# EAGLE design 4ch audio hub (EAGLE 7.7.0)
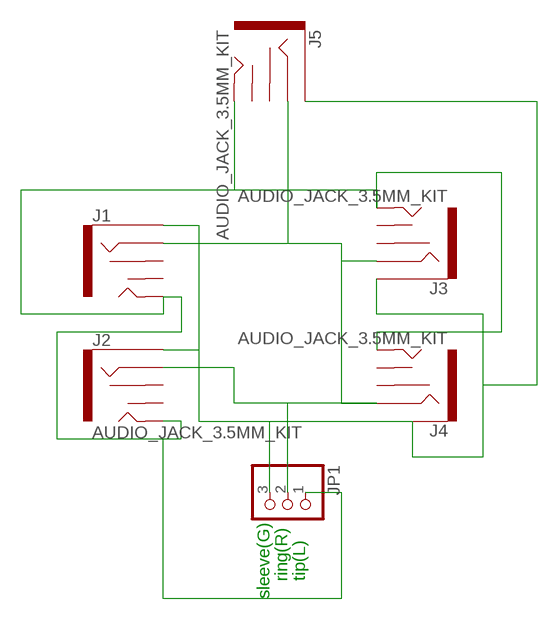
[diagram p0: schematic, sheet 1]

## Parts
J1  ring  AUDIO_JACK_3.5MM_KIT  [AUDIO-JACK-KIT]
J2  AUDIO_JACK_3.5MM_KIT  [AUDIO-JACK-KIT]
J3  AUDIO_JACK_3.5MM_KIT  [AUDIO-JACK-KIT]
J4  AUDIO_JACK_3.5MM_KIT  [AUDIO-JACK-KIT]
J5  AUDIO_JACK_3.5MM_KIT  [AUDIO-JACK-KIT]
JP1  PINHD-1X3  [1X03]

## Nets
N$1: J1.SLEEVE J2.SLEEVE J3.SLEEVE J4.SLEEVE J5.SLEEVE JP1.3
N$2: J1.RING J2.RING J3.RING J4.RING J5.RING JP1.2
N$3: J1.TIP J2.TIP J3.TIP J4.TIP J5.TIP JP1.1
Unconnected: J1.RSH J1.TSH J2.RSH J2.TSH J3.RSH J3.TSH J4.RSH J4.TSH J5.RSH J5.TSH

## Notes on the sheet
- ring(R) | tip(L)
- sleeve(G)

## Library data of the parts
J1-J5 = SparkFun-Connectors:AUDIO_JACK_3.5MM: Audio Jack 3.5mm variants of PTH and SMT stereo audio jack with bypass switches. SparkFun Products: SparkFun SparkPunk Sound Kit <[https://www.sparkfun.com/products/11177]> - PTH MP3 Trigger <https://www.sparkfun.com/products/13720> -3.5mm SMD SparkFun PicoBoard <https://www.sparkfun.com/products/11888>- 2.5mm SMD; PROD_ID: CONN-08774; SF_ID: PRT-08032
JP1 = pinhead:PINHD-1X3: PIN HEADER

## Board
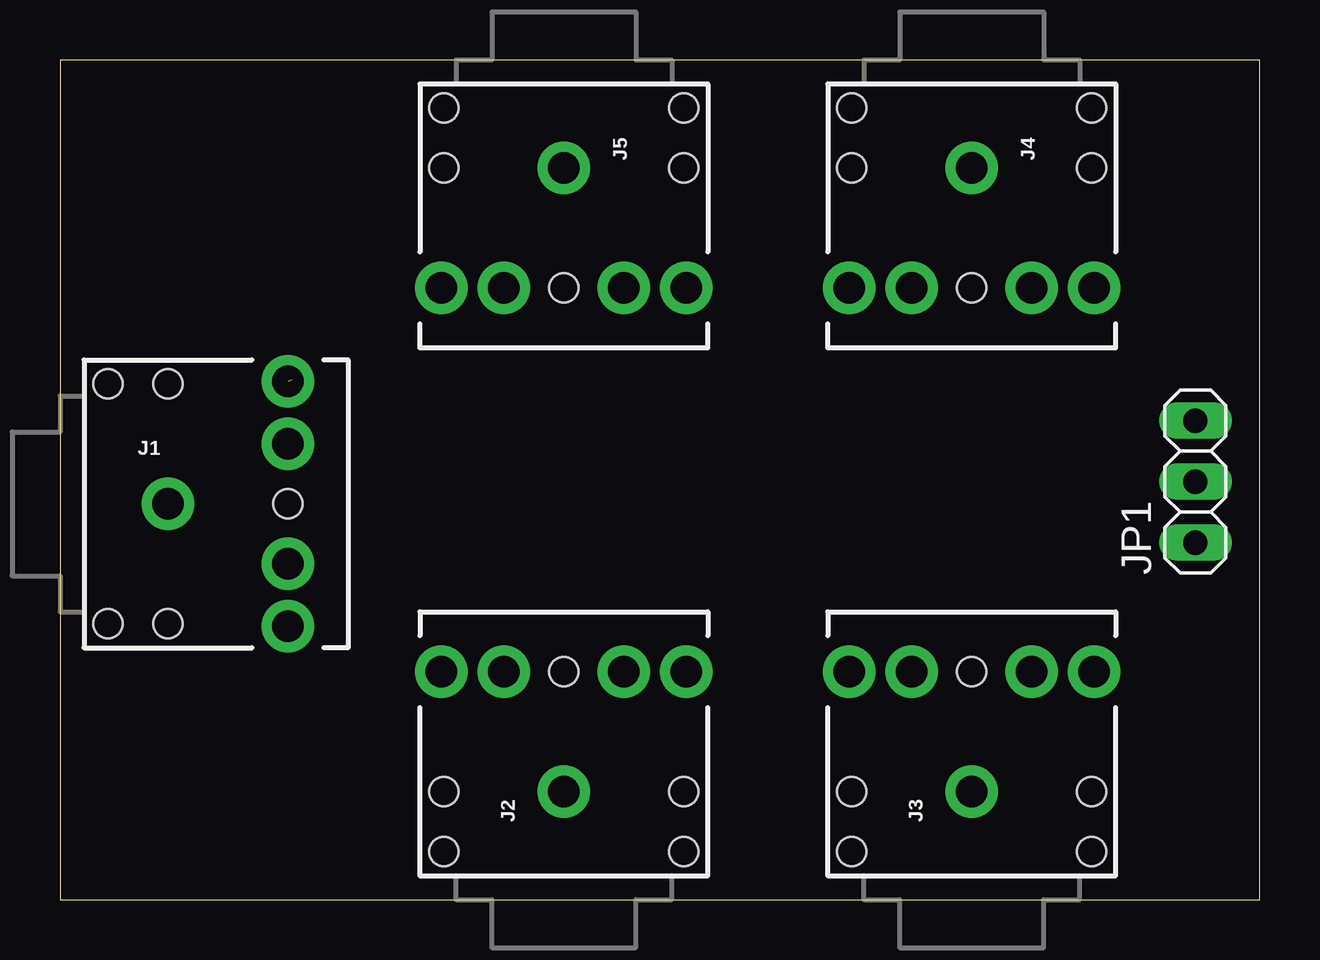
[diagram p1: board, top side]
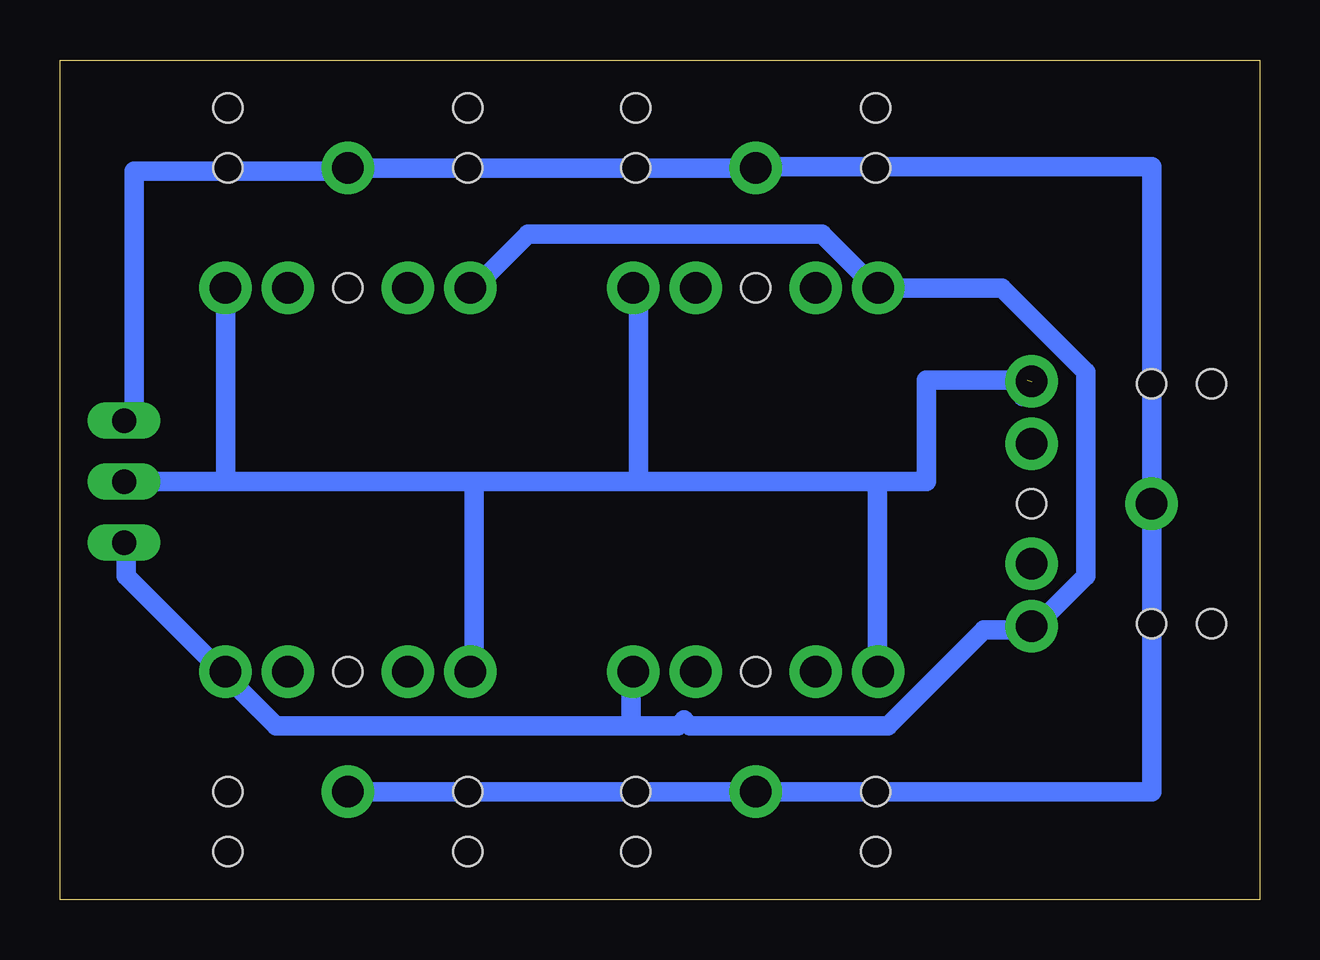
[diagram p2: board, bottom side, seen from below]

Size 50 x 35 mm. Coordinates in mm from the lower left corner, seen from the top.
Outline: 0,0 50,0 50,35 0,35 0,0
Copper layers (1*16): Top 0.035mm / dielectric 1.5mm / Bottom 0.035mm
Design rules "default *": minimum track width 32mil, minimum drill 24mil, track to track 8mil, track to pad 8mil, pad to pad 8mil, via to via 8mil, smd to smd 8mil, copper to edge 40mil, drill to drill 8mil, minimum pad ring 10mil, minimum via ring 8mil, stop-mask expansion 4mil, vias tented up to drill 0mil, thermal gap 10mil

### Footprints (pad centres in the part's own frame; a part is rotated, then mirrored left to right if it is on the bottom)
AUDIO-JACK-KIT = drill 1.3 pad 2.184: RING 5,5.1; RSH 5,2.5; SLEEVE 0,0; TIP 5,-5.1; TSH 5,-2.5 | hole 1.2: 0,5; -2.5,5; -2.5,-5; 0,-5; 5,0
1X03 = drill 1.016 long: 1 -2.54,0; 2 0,0; 3 2.54,0

### Placement (x,y rotation side)
J1  4.5,16.5 0 top
J2  21,4.5 90 top
J3  38,4.5 90 top
J4  38,30.5 270 top
J5  21,30.5 270 top
JP1  47.32,17.42 90 top

### Tracks (layer width: path | path; a pad name or v marks a point on that pad's centre or on a via)
N$1
  Bottom 0.813: JP1.3 46.9,19.96 46.9,30.36 38,30.36 J4.SLEEVE J5.SLEEVE 21,30.56 4.5,30.56 J1.SLEEVE 4.5,4.5 J2.SLEEVE J3.SLEEVE
N$2  (1 unrouted)
  Bottom 0.813: JP1.2 43.09,17.42 | 43.09,17.42 32.73,17.42 | 32.73,17.42 25.89,17.42 | 25.89,17.42 15.93,17.42 | 15.93,17.42 13.88,17.42 13.88,21.65 9.67,21.65 9.67,20.96 9.87,20.96 9.87,21.06 | J2.RING 15.93,9.5 15.93,17.42 | J3.RING 32.73,9.5 32.73,17.42 | J5.RING 25.89,25.5 25.89,17.42 | J4.RING 43.09,17.42
N$3
  Bottom 0.813: J4.TIP 32.75,25.5 30.5,27.75 18.25,27.75 16,25.5 J5.TIP 10.75,25.5 7.25,22 7.25,13.5 9.25,11.5 J1.TIP 9.5,11.25 11.5,11.25 15.5,7.25 23.75,7.25 24,7.5 24.25,7.25 26.19,7.25 | JP1.1 47.25,14.75 47.25,13.5 43.25,9.5 J3.TIP 43,9.25 41,7.25 26.19,7.25 | 26,9.5 J2.TIP 26.19,9.5 26.19,7.25